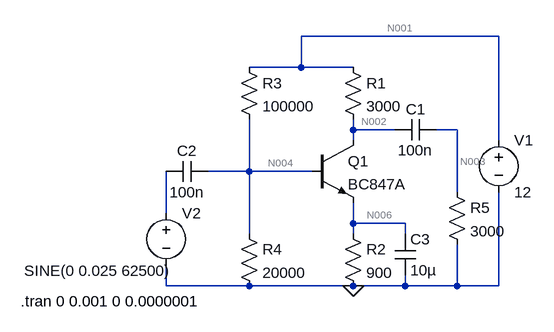
[diagram p0: schematic TEST_config.asc]
TEST_config.asc, the LTspice schematic file:
Version 4
SHEET 1 880 680
WIRE 368 -128 64 -128
WIRE 64 -80 64 -128
WIRE 64 -80 -16 -80
WIRE 144 -80 64 -80
WIRE 144 16 144 0
WIRE 208 16 144 16
WIRE 304 16 272 16
WIRE 144 32 144 16
WIRE 368 32 368 -128
WIRE -16 80 -16 0
WIRE -16 80 -80 80
WIRE 80 80 -16 80
WIRE 304 112 304 16
WIRE -144 144 -144 80
WIRE 144 160 144 128
WIRE 224 160 144 160
WIRE -16 176 -16 80
WIRE 144 176 144 160
WIRE 224 176 224 160
WIRE -144 256 -144 224
WIRE -16 256 -144 256
WIRE 144 256 -16 256
WIRE 224 256 224 240
WIRE 224 256 144 256
WIRE 304 256 304 192
WIRE 304 256 224 256
WIRE 368 256 368 112
WIRE 368 256 304 256
FLAG 144 256 0
SYMBOL npn 80 32 R0
SYMATTR InstName Q1
SYMATTR Value BC847A
SYMBOL res 128 -96 R0
SYMATTR InstName R1
SYMATTR Value 3000
SYMBOL res 128 160 R0
SYMATTR InstName R2
SYMATTR Value 900
SYMBOL res -32 -96 R0
SYMATTR InstName R3
SYMATTR Value 100000
SYMBOL res -32 160 R0
SYMATTR InstName R4
SYMATTR Value 20000
SYMBOL cap 272 0 R90
WINDOW 0 0 32 VBottom 2
WINDOW 3 32 32 VTop 2
SYMATTR InstName C1
SYMATTR Value 100n
SYMBOL cap -80 64 R90
WINDOW 0 0 32 VBottom 2
WINDOW 3 32 32 VTop 2
SYMATTR InstName C2
SYMATTR Value 100n
SYMBOL voltage 368 16 R0
WINDOW 123 0 0 Left 2
WINDOW 39 0 0 Left 2
SYMATTR InstName V1
SYMATTR Value 12
SYMBOL voltage -144 128 R0
WINDOW 3 -219 105 Left 2
WINDOW 123 0 0 Left 2
WINDOW 39 0 0 Left 2
SYMATTR Value SINE(0 0.025 62500)
SYMATTR InstName V2
SYMBOL cap 208 176 R0
SYMATTR InstName C3
SYMATTR Value 10µ
SYMBOL res 288 96 R0
SYMATTR InstName R5
SYMATTR Value 3000
TEXT -368 280 Left 2 !.tran 0 0.001 0 0.0000001

The netlist it stands for:
* TEST_config.asc
Q1 N002 N004 N006 0 BC847A
R1 N001 N002 3000
R2 N006 0 900
R3 N001 N004 100000
R4 N004 0 20000
C1 N003 N002 100n
C2 N004 N005 100n
V1 N001 0 12
V2 N005 0 SINE(0 0.025 62500)
C3 N006 0 10µ
R5 N003 0 3000
.model NPN NPN
.model PNP PNP
.lib standard.bjt
.tran 0 0.001 0 0.0000001
.backanno
.end

* Results of the author's LTspice run, read from the files saved beside the schematic
* Operating Point, zero values left out:
*   V(n002) = 7.959 V
*   V(n004) = 1.878 V
*   V(n006) = 1.219 V
*   V(n001) = 12 V
*   Ic(Q1) = 1.347 mA
*   Ib(Q1) = 7.313 µA
*   Ie(Q1) = -1.354 mA
*   I(R4) = 93.91 µA
*   I(R3) = 101.2 µA
*   I(R2) = 1.354 mA
*   I(R1) = 1.347 mA
*   I(V1) = -1.448 mA
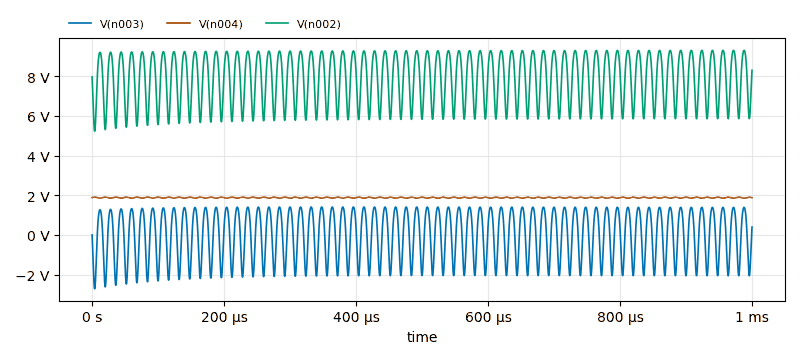
[diagram p1: Transient Analysis of TEST_config.asc, plotted from the saved traces]
* Transient Analysis, 1 run:
*   V(n003): min -2.714 V, max 1.406 V, average -18.32 mV, rms 1.241 V, last 397.7 mV
*   V(n004): min 1.851 V, max 1.903 V, average 1.877 V, rms 1.877 V, last 1.876 V
*   V(n002): min 5.224 V, max 9.297 V, average 7.863 V, rms 7.96 V, last 8.295 V